# Altium schematic sheet Monitoring IC.SchDoc
size A4; Organization: Waterloop; Address1: 200 University Ave W; Address2: Engineering 5, 1104; Address3: Waterloo, ON; Address4: N2L 3G1; SheetNumber: 1; SheetTotal: 5
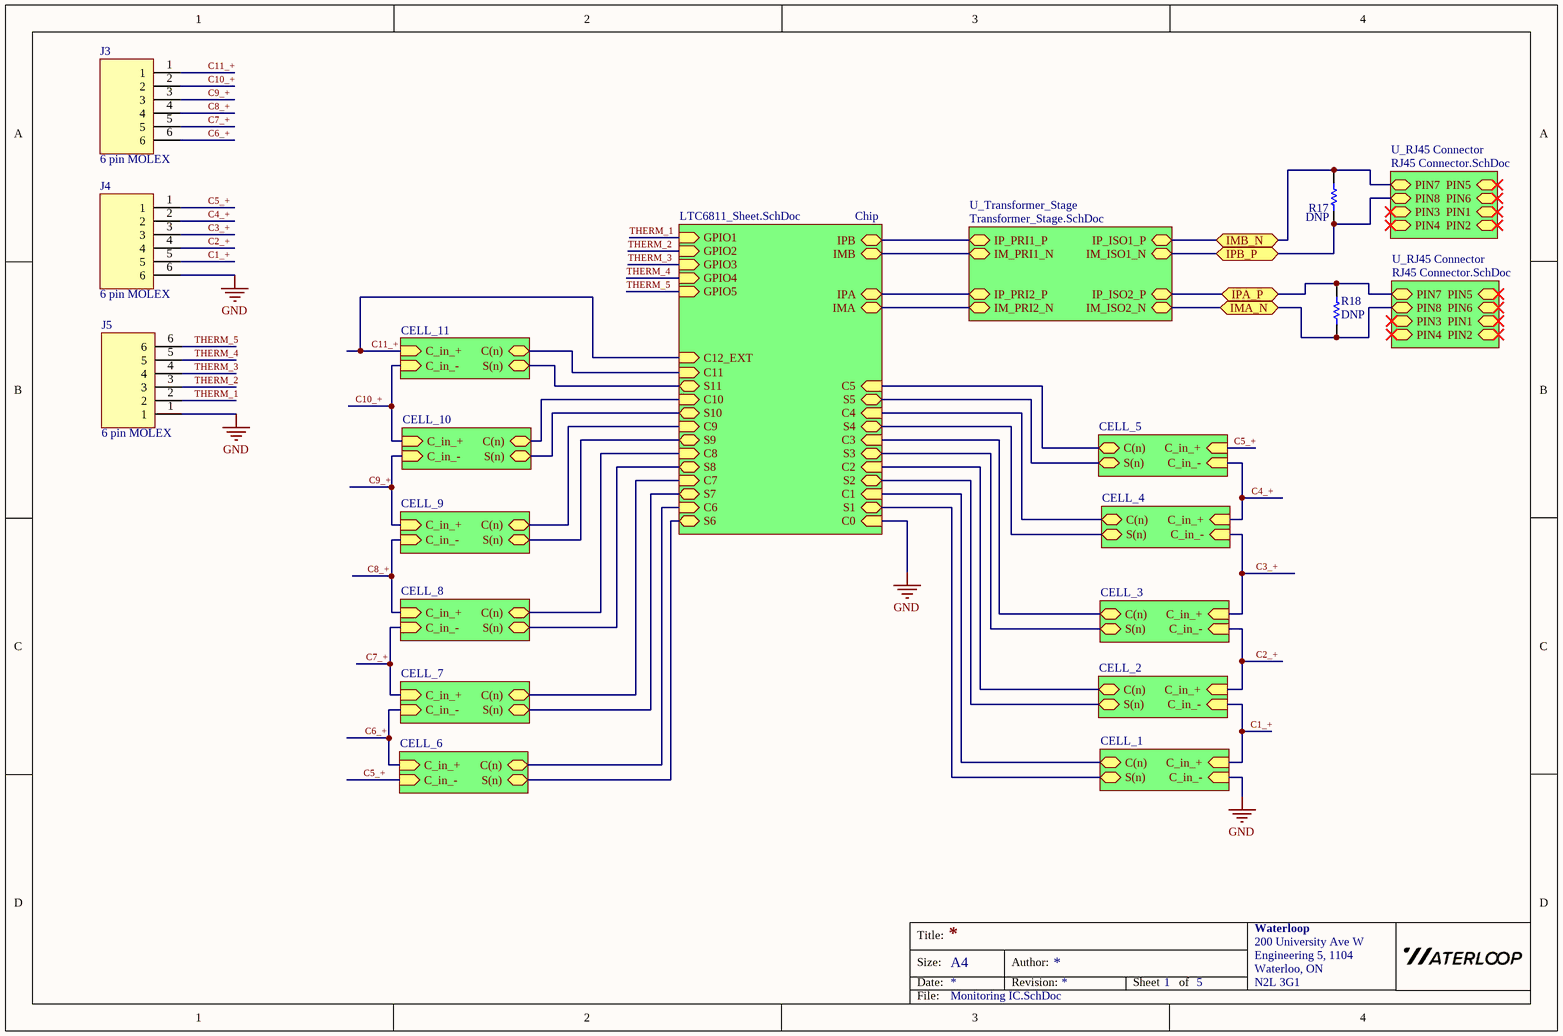
[diagram p0: Monitoring IC.SchDoc]

## Parts
J3  6 pin MOLEX  [1726480106]
J4  6 pin MOLEX  [1726480106]
J5  6 pin MOLEX  [1726480106]
R17  value DNP  [0805 - Resistor]  (hidden comment: Resistor)
R18  value DNP  [0805 - Resistor]  (hidden comment: Resistor)

## Sub-sheets
CELL_1 = Cell Balancing.SchDoc: S(n) (bidir), C(n) (bidir), C_in_+ (in), C_in_- (in)
CELL_2 = Cell Balancing.SchDoc: S(n) (bidir), C(n) (bidir), C_in_+ (in), C_in_- (in)
CELL_3 = Cell Balancing.SchDoc: S(n) (bidir), C(n) (bidir), C_in_+ (in), C_in_- (in)
CELL_4 = Cell Balancing.SchDoc: S(n) (bidir), C(n) (bidir), C_in_+ (in), C_in_- (in)
CELL_5 = Cell Balancing.SchDoc: S(n) (bidir), C(n) (bidir), C_in_+ (in), C_in_- (in)
CELL_6 = Cell Balancing.SchDoc: S(n) (bidir), C(n) (bidir), C_in_+ (in), C_in_- (in)
CELL_7 = Cell Balancing.SchDoc: S(n) (bidir), C(n) (bidir), C_in_+ (in), C_in_- (in)
CELL_8 = Cell Balancing.SchDoc: S(n) (bidir), C(n) (bidir), C_in_+ (in), C_in_- (in)
CELL_9 = Cell Balancing.SchDoc: S(n) (bidir), C(n) (bidir), C_in_+ (in), C_in_- (in)
CELL_10 = Cell Balancing.SchDoc: S(n) (bidir), C(n) (bidir), C_in_+ (in), C_in_- (in)
CELL_11 = Cell Balancing.SchDoc: S(n) (bidir), C(n) (bidir), C_in_+ (in), C_in_- (in)
Chip = LTC6811_Sheet.SchDoc: IPB (bidir), IMB (bidir), IPA (bidir), IMA (bidir), C0 (in), C1 (in), C2 (in), C3 (in), C4 (in), C5 (in), C6 (in), C7 (in), C8 (in), C9 (in), C10 (in), C11 (in), S1 (bidir), S2 (bidir), S3 (bidir), S4 (bidir), S5 (bidir), S6 (bidir), S7 (bidir), S8 (bidir), S9 (bidir), S10 (bidir), S11 (bidir), GPIO1 (in), GPIO2 (in), GPIO3 (in), GPIO4 (in), GPIO5 (in), C12_EXT (in)
U_RJ45 Connector = RJ45 Connector.SchDoc: PIN1 (bidir), PIN2 (bidir), PIN3 (bidir), PIN4 (bidir), PIN5 (bidir), PIN6 (bidir), PIN7 (bidir), PIN8 (bidir)
U_RJ45 Connector = RJ45 Connector.SchDoc: PIN1 (bidir), PIN2 (bidir), PIN3 (bidir), PIN4 (bidir), PIN5 (bidir), PIN6 (bidir), PIN7 (bidir), PIN8 (bidir)
U_Transformer_Stage = Transformer_Stage.SchDoc: IP_PRI1_P (bidir), IM_PRI1_N (bidir), IP_ISO1_P (bidir), IM_ISO1_N (bidir), IP_PRI2_P (bidir), IM_PRI2_N (bidir), IP_ISO2_P (bidir), IM_ISO2_N (bidir)

## Ports
IMA_N (bidir), IMB_N (bidir), IPA_P (bidir), IPB_P (bidir)

## Nets
GND: J4.6 J5.1 ; sheet Chip/C0, sheet CELL_1/C_in_-
C1_+: J4.5 ; sheet CELL_2/C_in_-, sheet CELL_1/C_in_+
C2_+: J4.4 ; sheet CELL_3/C_in_-, sheet CELL_2/C_in_+
C3_+: J4.3 ; sheet CELL_4/C_in_-, sheet CELL_3/C_in_+
C4_+: J4.2 ; sheet CELL_5/C_in_-, sheet CELL_4/C_in_+
C5_+: J4.1 ; sheet CELL_5/C_in_+, sheet CELL_6/C_in_-
C6_+: J3.6 ; sheet CELL_7/C_in_-, sheet CELL_6/C_in_+
C7_+: J3.5 ; sheet CELL_8/C_in_-, sheet CELL_7/C_in_+
C8_+: J3.4 ; sheet CELL_9/C_in_-, sheet CELL_8/C_in_+
C9_+: J3.3 ; sheet CELL_10/C_in_-, sheet CELL_9/C_in_+
C10_+: J3.2 ; sheet CELL_11/C_in_-, sheet CELL_10/C_in_+
C11_+: J3.1 ; sheet Chip/C12_EXT, sheet CELL_11/C_in_+
IMA_N: R18.2 ; port IMA_N, sheet U_RJ45 Connector/PIN8, sheet U_Transformer_Stage/IM_ISO2_N
IMB_N: R17.2 ; port IMB_N, sheet U_RJ45 Connector/PIN7, sheet U_Transformer_Stage/IP_ISO1_P
IPA_P: R18.1 ; port IPA_P, sheet U_RJ45 Connector/PIN7, sheet U_Transformer_Stage/IP_ISO2_P
IPB_P: R17.1 ; port IPB_P, sheet U_RJ45 Connector/PIN8, sheet U_Transformer_Stage/IM_ISO1_N
THERM_1: J5.2 ; sheet Chip/GPIO1
THERM_2: J5.3 ; sheet Chip/GPIO2
THERM_3: J5.4 ; sheet Chip/GPIO3
THERM_4: J5.5 ; sheet Chip/GPIO4
THERM_5: J5.6 ; sheet Chip/GPIO5
(unnamed): sheet Chip/IPB, sheet U_Transformer_Stage/IP_PRI1_P
(unnamed): sheet Chip/IMB, sheet U_Transformer_Stage/IM_PRI1_N
(unnamed): sheet Chip/IPA, sheet U_Transformer_Stage/IP_PRI2_P
(unnamed): sheet Chip/IMA, sheet U_Transformer_Stage/IM_PRI2_N
(unnamed): sheet Chip/C1, sheet CELL_1/C(n)
(unnamed): sheet Chip/C2, sheet CELL_2/C(n)
(unnamed): sheet Chip/C3, sheet CELL_3/C(n)
(unnamed): sheet Chip/C4, sheet CELL_4/C(n)
(unnamed): sheet Chip/C5, sheet CELL_5/C(n)
(unnamed): sheet Chip/C6, sheet CELL_6/C(n)
(unnamed): sheet Chip/C7, sheet CELL_7/C(n)
(unnamed): sheet Chip/C8, sheet CELL_8/C(n)
(unnamed): sheet Chip/C9, sheet CELL_9/C(n)
(unnamed): sheet Chip/C10, sheet CELL_10/C(n)
(unnamed): sheet Chip/C11, sheet CELL_11/C(n)
(unnamed): sheet Chip/S1, sheet CELL_1/S(n)
(unnamed): sheet Chip/S2, sheet CELL_2/S(n)
(unnamed): sheet Chip/S3, sheet CELL_3/S(n)
(unnamed): sheet Chip/S4, sheet CELL_4/S(n)
(unnamed): sheet Chip/S5, sheet CELL_5/S(n)
(unnamed): sheet Chip/S6, sheet CELL_6/S(n)
(unnamed): sheet Chip/S7, sheet CELL_7/S(n)
(unnamed): sheet Chip/S8, sheet CELL_8/S(n)
(unnamed): sheet Chip/S9, sheet CELL_9/S(n)
(unnamed): sheet Chip/S10, sheet CELL_10/S(n)
(unnamed): sheet Chip/S11, sheet CELL_11/S(n)

## Notes on the sheet
- Title:
- Size:
- Date:
- A4
- Author:
- Revision:
- Sheet
- of
- File:

## Library data of the parts
J3-J5 = MOLEX1726480106: 1x6 MOLEX MiniFit Jr. Connector
R17 R18 = Resistor: Rating: *; Manufacturer Part Number: *; Manufacturer: *; Supplier Part Number: *; Supplier: *